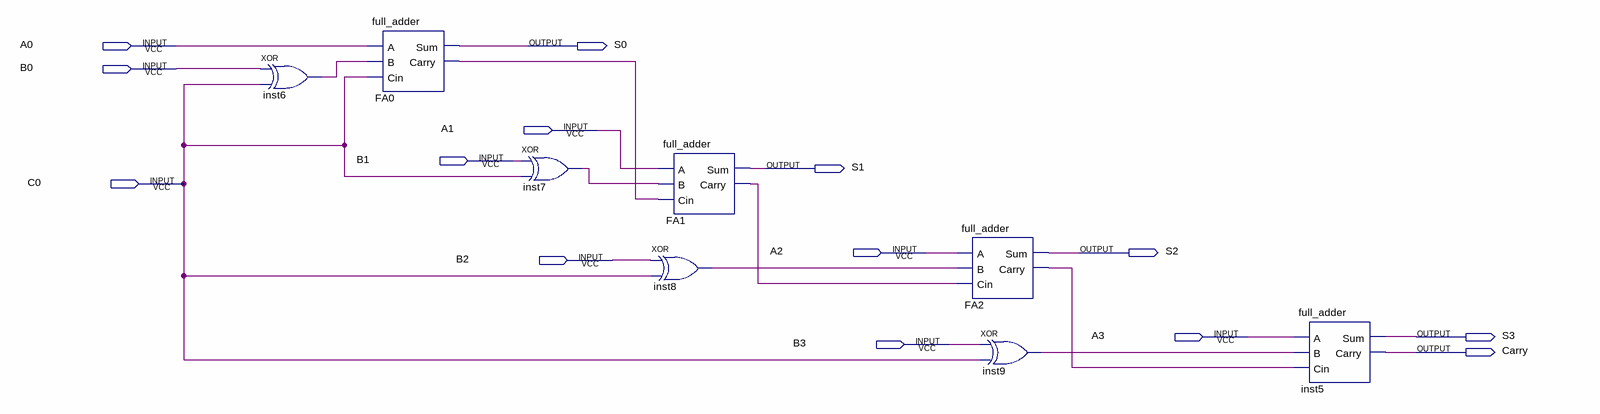
[diagram p0: schematic sheet]
// Quartus schematic Sub_Diagram.bdf as structural Verilog: 8 symbols, 14 pins
module Sub_Diagram (
  input  A0,
  input  B0,
  input  A1,
  input  B1,
  input  C0,
  input  A2,
  input  B2,
  input  A3,
  input  B3,
  output S0,
  output S1,
  output S2,
  output S3,
  output Carry
);

  wire FA0_carry, FA1_carry, FA2_carry, inst6_out, inst7_out, inst8_out, inst9_out;

  xor inst6 (inst6_out, B0, C0);
  full_adder FA0 (.A(A0), .B(inst6_out), .Cin(C0), .Sum(S0), .Carry(FA0_carry));
  xor inst7 (inst7_out, B1, C0);
  full_adder FA1 (.A(A1), .B(inst7_out), .Cin(FA0_carry), .Sum(S1), .Carry(FA1_carry));
  xor inst8 (inst8_out, B2, C0);
  full_adder FA2 (.A(A2), .B(inst8_out), .Cin(FA1_carry), .Sum(S2), .Carry(FA2_carry));
  xor inst9 (inst9_out, B3, C0);
  full_adder inst5 (.A(A3), .B(inst9_out), .Cin(FA2_carry), .Sum(S3), .Carry(Carry));
endmodule
